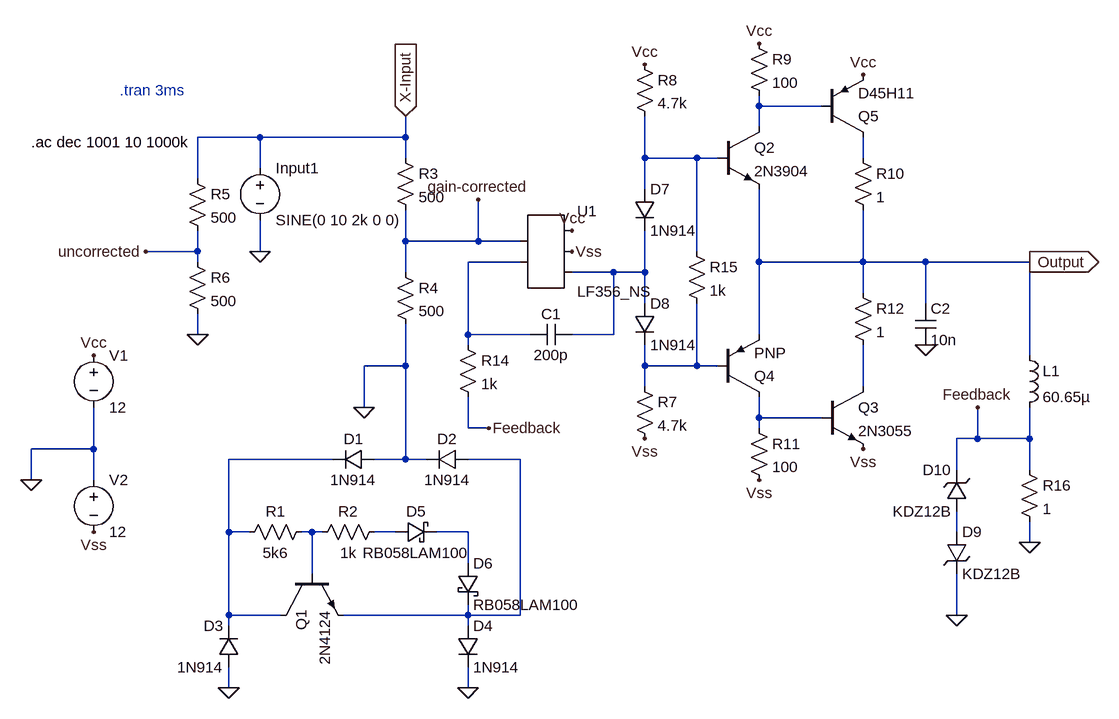
[diagram p0: schematic Atari Deflector X - Op Amp.asc]
Atari Deflector X - Op Amp.asc, the LTspice schematic file:
Version 4
SHEET 1 1588 756
WIRE 768 -368 768 -384
WIRE 864 -368 768 -368
WIRE 768 -336 768 -368
WIRE 0 -320 -96 -320
WIRE 224 -320 224 -352
WIRE 224 -320 0 -320
WIRE 224 -288 224 -320
WIRE 592 -288 592 -352
WIRE 672 -288 592 -288
WIRE 704 -288 672 -288
WIRE 928 -288 928 -320
WIRE 0 -272 0 -320
WIRE -96 -256 -96 -320
WIRE 592 -240 592 -288
WIRE 224 -160 224 -208
WIRE 336 -160 336 -224
WIRE 336 -160 224 -160
WIRE 400 -160 336 -160
WIRE -96 -144 -96 -176
WIRE -96 -144 -176 -144
WIRE 0 -144 0 -192
WIRE 672 -144 672 -288
WIRE -96 -128 -96 -144
WIRE 400 -128 320 -128
WIRE 768 -128 768 -240
WIRE 928 -128 928 -208
WIRE 928 -128 768 -128
WIRE 1024 -128 928 -128
WIRE 1184 -128 1024 -128
WIRE 224 -112 224 -160
WIRE 544 -112 480 -112
WIRE 592 -112 592 -176
WIRE 592 -112 544 -112
WIRE 928 -80 928 -128
WIRE 592 -64 592 -112
WIRE 1024 -64 1024 -128
WIRE -96 -16 -96 -48
WIRE 320 -16 320 -128
WIRE 416 -16 320 -16
WIRE 544 -16 544 -112
WIRE 544 -16 480 -16
WIRE 768 -16 768 -128
WIRE 320 0 320 -16
WIRE 1184 16 1184 -128
WIRE 224 32 224 -32
WIRE 224 32 160 32
WIRE 592 32 592 0
WIRE 672 32 672 -64
WIRE 672 32 592 32
WIRE 704 32 672 32
WIRE 592 64 592 32
WIRE 928 64 928 0
WIRE 160 96 160 32
WIRE 768 112 768 80
WIRE 864 112 768 112
WIRE 320 128 320 80
WIRE 352 128 320 128
WIRE 768 128 768 112
WIRE 1104 144 1104 96
WIRE 1104 144 1072 144
WIRE 1184 144 1184 96
WIRE 1184 144 1104 144
WIRE -256 160 -256 96
WIRE -256 160 -352 160
WIRE 112 176 -48 176
WIRE 224 176 224 32
WIRE 224 176 176 176
WIRE 256 176 224 176
WIRE 400 176 320 176
WIRE 1072 192 1072 144
WIRE 1184 192 1184 144
WIRE -352 208 -352 160
WIRE -256 208 -256 160
WIRE -48 288 -48 176
WIRE -16 288 -48 288
WIRE 80 288 64 288
WIRE 96 288 80 288
WIRE 208 288 176 288
WIRE 320 288 272 288
WIRE 1072 288 1072 256
WIRE 1184 304 1184 272
WIRE 320 336 320 288
WIRE 80 352 80 288
WIRE -48 416 -48 288
WIRE 32 416 -48 416
WIRE 320 416 320 400
WIRE 320 416 128 416
WIRE 400 416 400 176
WIRE 400 416 320 416
WIRE 1072 416 1072 352
WIRE -48 432 -48 416
WIRE 320 432 320 416
WIRE -48 528 -48 496
WIRE 320 528 320 496
FLAG -48 528 0
FLAG 320 528 0
FLAG 224 -352 X-Input
IOPIN 224 -352 In
FLAG 0 -144 0
FLAG -96 -16 0
FLAG -176 -144 uncorrected
FLAG -352 208 0
FLAG -256 288 Vss
FLAG 336 -224 gain-corrected
FLAG 480 -176 Vcc
FLAG 480 -144 Vss
FLAG 592 -432 Vcc
FLAG 592 144 Vss
FLAG 768 -464 Vcc
FLAG 928 -416 Vcc
FLAG 768 208 Vss
FLAG 928 160 Vss
FLAG 1024 0 0
FLAG 160 96 0
FLAG -256 16 Vcc
FLAG 1184 304 0
FLAG 1184 -128 Output
IOPIN 1184 -128 Out
FLAG 1072 416 0
FLAG 1104 96 Feedback
FLAG 352 128 Feedback
SYMBOL diode 176 160 R90
WINDOW 0 0 32 VBottom 2
WINDOW 3 32 32 VTop 2
SYMATTR InstName D1
SYMATTR Value 1N914
SYMBOL diode 320 160 R90
WINDOW 0 0 32 VBottom 2
WINDOW 3 32 32 VTop 2
SYMATTR InstName D2
SYMATTR Value 1N914
SYMBOL diode -32 496 R180
WINDOW 0 24 64 Left 2
WINDOW 3 24 0 Left 2
SYMATTR InstName D3
SYMATTR Value 1N914
SYMBOL diode 304 432 R0
SYMATTR InstName D4
SYMATTR Value 1N914
SYMBOL schottky 208 304 R270
WINDOW 0 32 32 VTop 2
WINDOW 3 0 32 VBottom 2
SYMATTR InstName D5
SYMATTR Value RB058LAM100
SYMATTR Description Diode
SYMATTR Type diode
SYMBOL schottky 304 336 R0
SYMATTR InstName D6
SYMATTR Value RB058LAM100
SYMATTR Description Diode
SYMATTR Type diode
SYMBOL npn 32 352 M90
SYMATTR InstName Q1
SYMATTR Value 2N4124
SYMBOL res 80 272 R90
WINDOW 0 0 56 VBottom 2
WINDOW 3 32 56 VTop 2
SYMATTR InstName R1
SYMATTR Value 5k6
SYMBOL res 192 272 R90
WINDOW 0 0 56 VBottom 2
WINDOW 3 32 56 VTop 2
SYMATTR InstName R2
SYMATTR Value 1k
SYMBOL res 208 -304 R0
SYMATTR InstName R3
SYMATTR Value 500
SYMBOL res 208 -128 R0
SYMATTR InstName R4
SYMATTR Value 500
SYMBOL voltage 0 -288 R0
SYMATTR InstName Input1
SYMATTR Value SINE(0 10 2k 0 0)
SYMATTR Value2 AC 1V
SYMBOL res -112 -272 R0
SYMATTR InstName R5
SYMATTR Value 500
SYMBOL res -112 -144 R0
SYMATTR InstName R6
SYMATTR Value 500
SYMBOL voltage -256 0 R0
SYMATTR InstName V1
SYMATTR Value 12
SYMBOL voltage -256 192 R0
SYMATTR InstName V2
SYMATTR Value 12
SYMBOL AutoGenerated/LF356_NS 432 -144 R0
SYMATTR InstName U1
SYMBOL diode 576 -240 R0
SYMATTR InstName D7
SYMATTR Value 1N914
SYMBOL diode 576 -64 R0
SYMATTR InstName D8
SYMATTR Value 1N914
SYMBOL res 576 48 R0
SYMATTR InstName R7
SYMATTR Value 4.7k
SYMBOL res 576 -448 R0
SYMATTR InstName R8
SYMATTR Value 4.7k
SYMBOL npn 704 -336 R0
SYMATTR InstName Q2
SYMATTR Value 2N3904
SYMBOL res 752 -480 R0
SYMATTR InstName R9
SYMATTR Value 100
SYMBOL npn 864 64 R0
SYMATTR InstName Q3
SYMATTR Value 2N3055
SYMBOL res 912 -304 R0
SYMATTR InstName R10
SYMATTR Value 1
SYMBOL res 752 112 R0
SYMATTR InstName R11
SYMATTR Value 100
SYMBOL res 912 -96 R0
SYMATTR InstName R12
SYMATTR Value 1
SYMBOL pnp 704 80 M180
SYMATTR InstName Q4
SYMBOL pnp 864 -320 M180
SYMATTR InstName Q5
SYMATTR Value D45H11
SYMBOL res 304 -16 R0
SYMATTR InstName R14
SYMATTR Value 1k
SYMBOL cap 480 -32 R90
WINDOW 0 0 32 VBottom 2
WINDOW 3 32 32 VTop 2
SYMATTR InstName C1
SYMATTR Value 200p
SYMBOL cap 1008 -64 R0
SYMATTR InstName C2
SYMATTR Value 10n
SYMBOL res 656 -160 R0
SYMATTR InstName R15
SYMATTR Value 1k
SYMBOL ind 1168 0 R0
SYMATTR InstName L1
SYMATTR Value 60.65µ
SYMBOL res 1168 176 R0
SYMATTR InstName R16
SYMATTR Value 1
SYMBOL zener 1056 288 R0
SYMATTR InstName D9
SYMATTR Value KDZ12B
SYMATTR Description Diode
SYMATTR Type diode
SYMBOL zener 1088 256 R180
WINDOW 0 24 64 Left 2
WINDOW 3 24 0 Left 2
SYMATTR InstName D10
SYMATTR Value KDZ12B
SYMATTR Description Diode
SYMATTR Type diode
TEXT -216 -392 Left 2 ;.tran 3ms
TEXT -352 -312 Left 2 !.ac dec 1001 10 1000k

The netlist it stands for:
* Atari Deflector X - Op Amp.asc
D1 0 N009 1N914
D2 N010 0 1N914
D3 0 N009 1N914
D4 N010 0 1N914
D5 N012 N013 RB058LAM100
D6 N013 N010 RB058LAM100
Q1 N009 N011 N010 0 2N4124
R1 N011 N009 5k6
R2 N012 N011 1k
R3 X-Input gain-corrected 500
R4 gain-corrected 0 500
V§Input1 X-Input 0 SINE(0 10 2k 0 0) AC 1V
R5 X-Input uncorrected 500
R6 uncorrected 0 500
V1 Vcc 0 12
V2 0 Vss 12
* U1: LF356_NS (symbol AutoGenerated/LF356_NS not available, pins judged from their places): pin1=gain-corrected pin2=N004 pin3=Vcc pin4=Vss pin5=N005
D7 N002 N005 1N914
D8 N005 N006 1N914
R7 N006 Vss 4.7k
R8 Vcc N002 4.7k
Q2 N001 N002 Output 0 2N3904
R9 Vcc N001 100
Q3 N007 N008 Vss 0 2N3055
R10 N003 Output 1
R11 N008 Vss 100
R12 Output N007 1
Q4 N008 N006 Output 0 PNP
Q5 N003 N001 Vcc 0 D45H11
R14 N004 Feedback 1k
C1 N005 N004 200p
C2 Output 0 10n
R15 N002 N006 1k
L1 Output Feedback 60.65µ
R16 Feedback 0 1
D9 N014 0 KDZ12B
D10 N014 Feedback KDZ12B
.model D D
.lib standard.dio
.model NPN NPN
.model PNP PNP
.lib standard.bjt
* .tran 3ms
.ac dec 1001 10 1000k
.backanno
.end